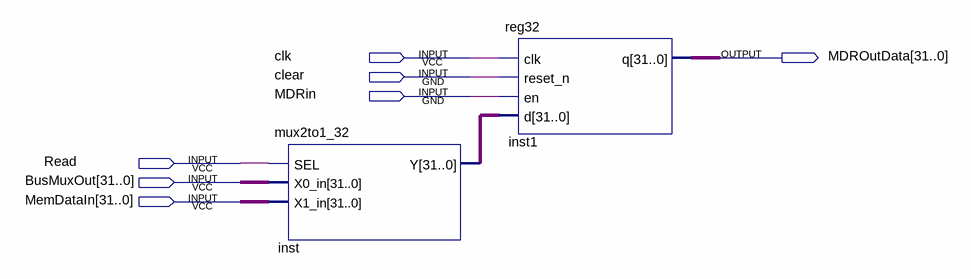
[diagram p0: schematic sheet]
// Quartus schematic mdr_design.bdf as structural Verilog: 2 symbols, 7 pins
module mdr_design (
  input  clk,
  input  clear,
  input  MDRin,
  input  Read,
  input  [31:0] BusMuxOut,
  input  [31:0] MemDataIn,
  output [31:0] MDROutData
);

  wire [31:0] inst_y;

  mux2to1_32 inst (.SEL(Read), .X0_in(BusMuxOut), .X1_in(MemDataIn), .Y(inst_y));
  reg32 inst1 (.clk(clk), .reset_n(clear), .en(MDRin), .d(inst_y), .q(MDROutData));
endmodule
